# EAGLE design umodular_pot16 (EAGLE 7.2.0)
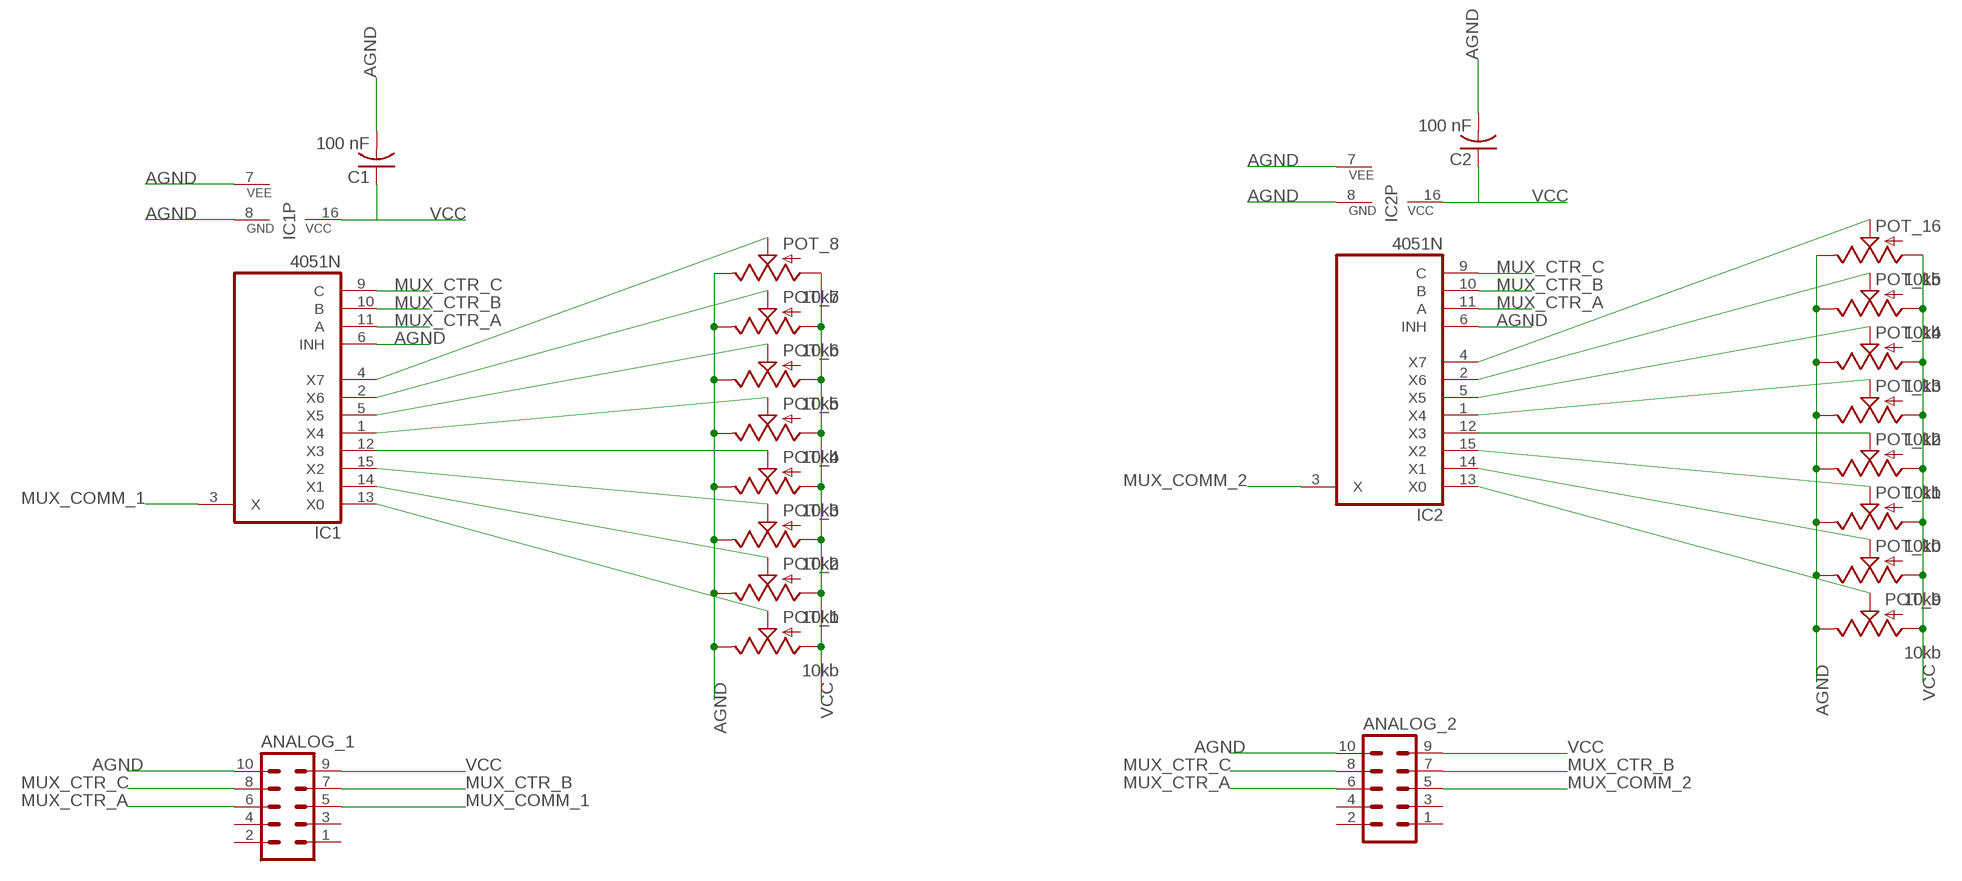
[diagram p0: schematic, sheet 1]

## Parts
ANALOG_1  MA05-2  [MA05-2]
ANALOG_2  MA05-2  [MA05-2]
C1  100 nF  C-US050-024X044  [C050-024X044]
C2  100 nF  C-US050-024X044  [C050-024X044]
IC1  4051N  [DIL16]
IC2  4051N  [DIL16]
POT_1  10kb  POT  [ALPS_POT]
POT_2  10kb  POT  [ALPS_POT]
POT_3  10kb  POT  [ALPS_POT]
POT_4  10kb  POT  [ALPS_POT]
POT_5  10kb  POT  [ALPS_POT]
POT_6  10kb  POT  [ALPS_POT]
POT_7  10kb  POT  [ALPS_POT]
POT_8  10kb  POT  [ALPS_POT]
POT_9  10kb  POT  [ALPS_POT]
POT_10  10kb  POT  [ALPS_POT]
POT_11  10kb  POT  [ALPS_POT]
POT_12  10kb  POT  [ALPS_POT]
POT_13  10kb  POT  [ALPS_POT]
POT_14  10kb  POT  [ALPS_POT]
POT_15  10kb  POT  [ALPS_POT]
POT_16  10kb  POT  [ALPS_POT]

## Nets
AGND: ANALOG_1.10 ANALOG_2.10 C1.2 C2.2 IC1.6(INH) IC1.7(VEE) IC1.8(GND) IC2.6(INH) IC2.7(VEE) IC2.8(GND) POT_1.P$1(E) POT_2.P$1(E) POT_3.P$1(E) POT_4.P$1(E) POT_5.P$1(E) POT_6.P$1(E) POT_7.P$1(E) POT_8.P$1(E) POT_9.P$1(E) POT_10.P$1(E) POT_11.P$1(E) POT_12.P$1(E) POT_13.P$1(E) POT_14.P$1(E) POT_15.P$1(E) POT_16.P$1(E)
MUX_COMM_1: ANALOG_1.5 IC1.3(X)
MUX_COMM_2: ANALOG_2.5 IC2.3(X)
MUX_CTR_A: ANALOG_1.6 ANALOG_2.6 IC1.11(A) IC2.11(A)
MUX_CTR_B: ANALOG_1.7 ANALOG_2.7 IC1.10(B) IC2.10(B)
MUX_CTR_C: ANALOG_1.8 ANALOG_2.8 IC1.9(C) IC2.9(C)
N$1: IC1.13(X0) POT_1.P$2(S)
N$10: IC1.14(X1) POT_2.P$2(S)
N$11: IC1.15(X2) POT_3.P$2(S)
N$12: IC1.12(X3) POT_4.P$2(S)
N$13: IC1.1(X4) POT_5.P$2(S)
N$14: IC1.5(X5) POT_6.P$2(S)
N$15: IC1.2(X6) POT_7.P$2(S)
N$16: IC1.4(X7) POT_8.P$2(S)
N$274: IC2.13(X0) POT_9.P$2(S)
N$275: IC2.14(X1) POT_10.P$2(S)
N$276: IC2.15(X2) POT_11.P$2(S)
N$277: IC2.12(X3) POT_12.P$2(S)
N$278: IC2.1(X4) POT_13.P$2(S)
N$279: IC2.5(X5) POT_14.P$2(S)
N$280: IC2.2(X6) POT_15.P$2(S)
N$281: IC2.4(X7) POT_16.P$2(S)
VCC: ANALOG_1.9 ANALOG_2.9 C1.1 C2.1 IC1.16(VCC) IC2.16(VCC) POT_1.P$3(A) POT_2.P$3(A) POT_3.P$3(A) POT_4.P$3(A) POT_5.P$3(A) POT_6.P$3(A) POT_7.P$3(A) POT_8.P$3(A) POT_9.P$3(A) POT_10.P$3(A) POT_11.P$3(A) POT_12.P$3(A) POT_13.P$3(A) POT_14.P$3(A) POT_15.P$3(A) POT_16.P$3(A)
Unconnected: ANALOG_1.1 ANALOG_1.2 ANALOG_1.3 ANALOG_1.4 ANALOG_2.1 ANALOG_2.2 ANALOG_2.3 ANALOG_2.4

## Library data of the parts
ANALOG_1 ANALOG_2 = con-lstb:MA05-2: PIN HEADER; OC_FARNELL: unknown; OC_NEWARK: unknown
C1 C2 = rcl:C-US: CAPACITOR, American symbol
IC1 IC2 = 40xx:4051: 8-channel ANALOG MULTIPLEXER
POT_1-POT_16 = SparkFun-Electromechanical_mod:POT

## Board
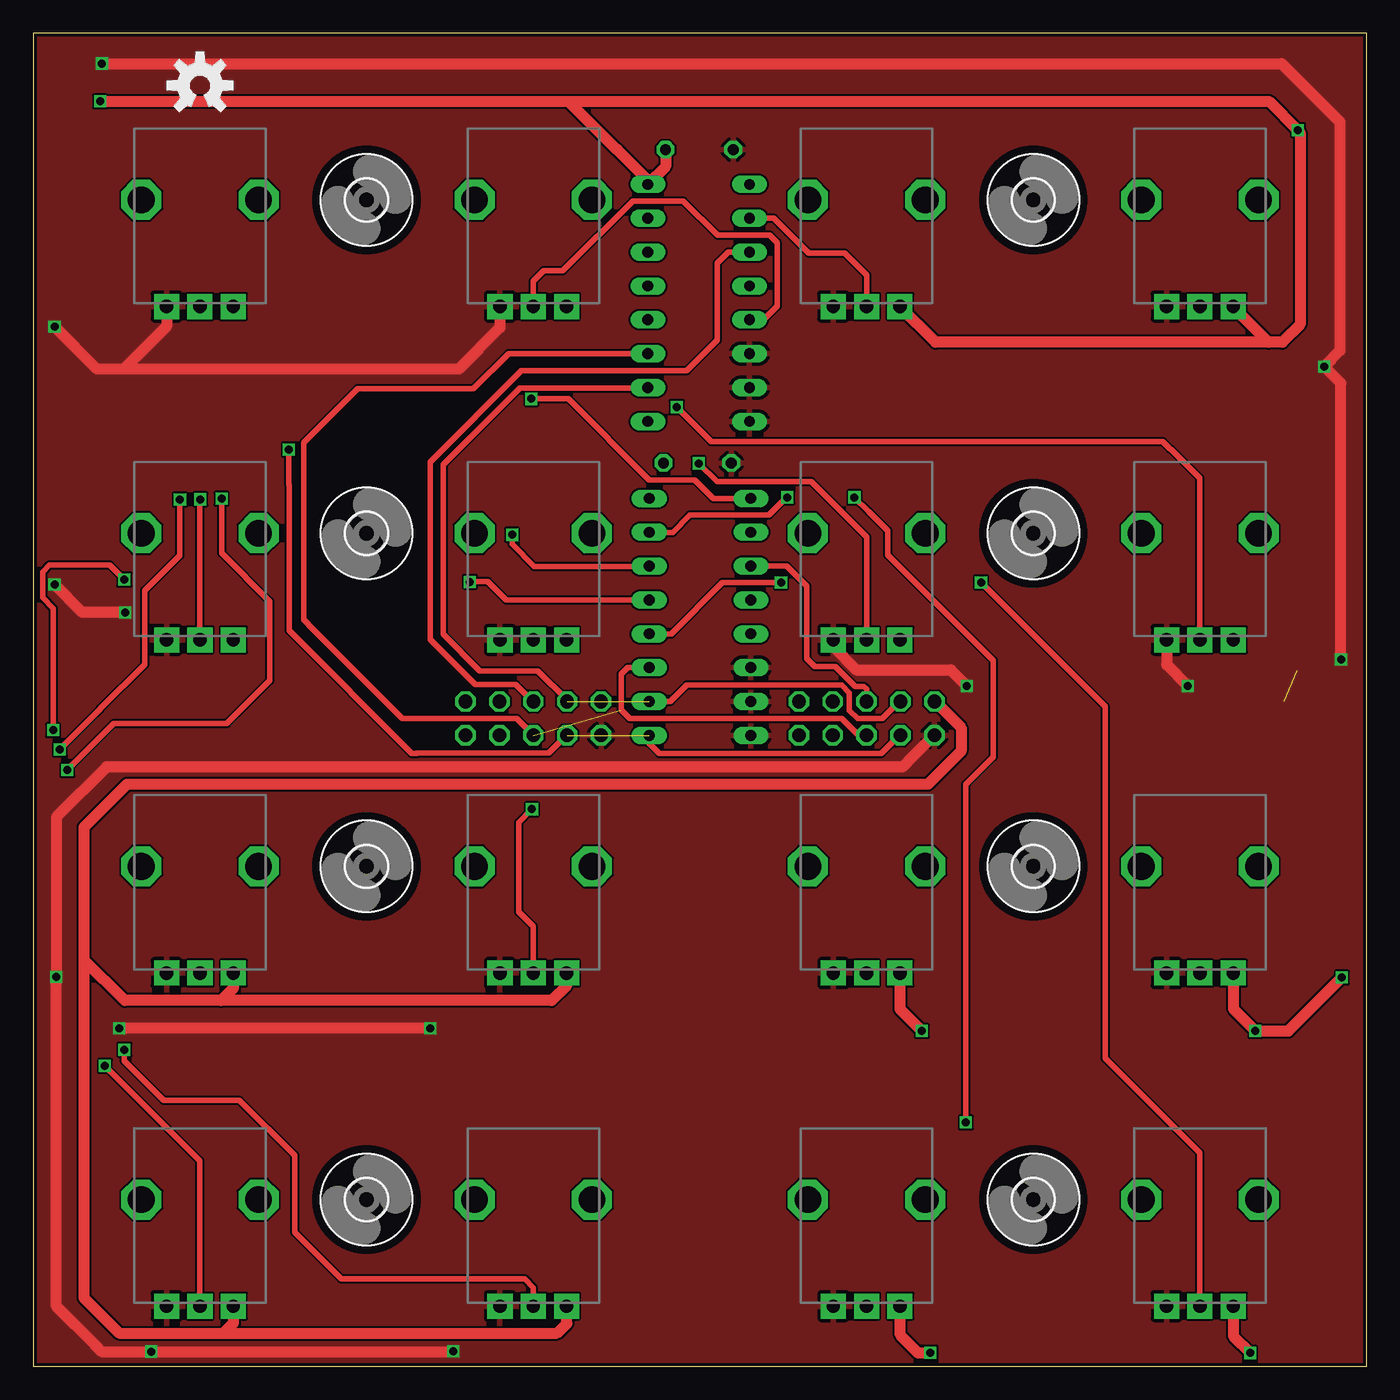
[diagram p1: board, top side]
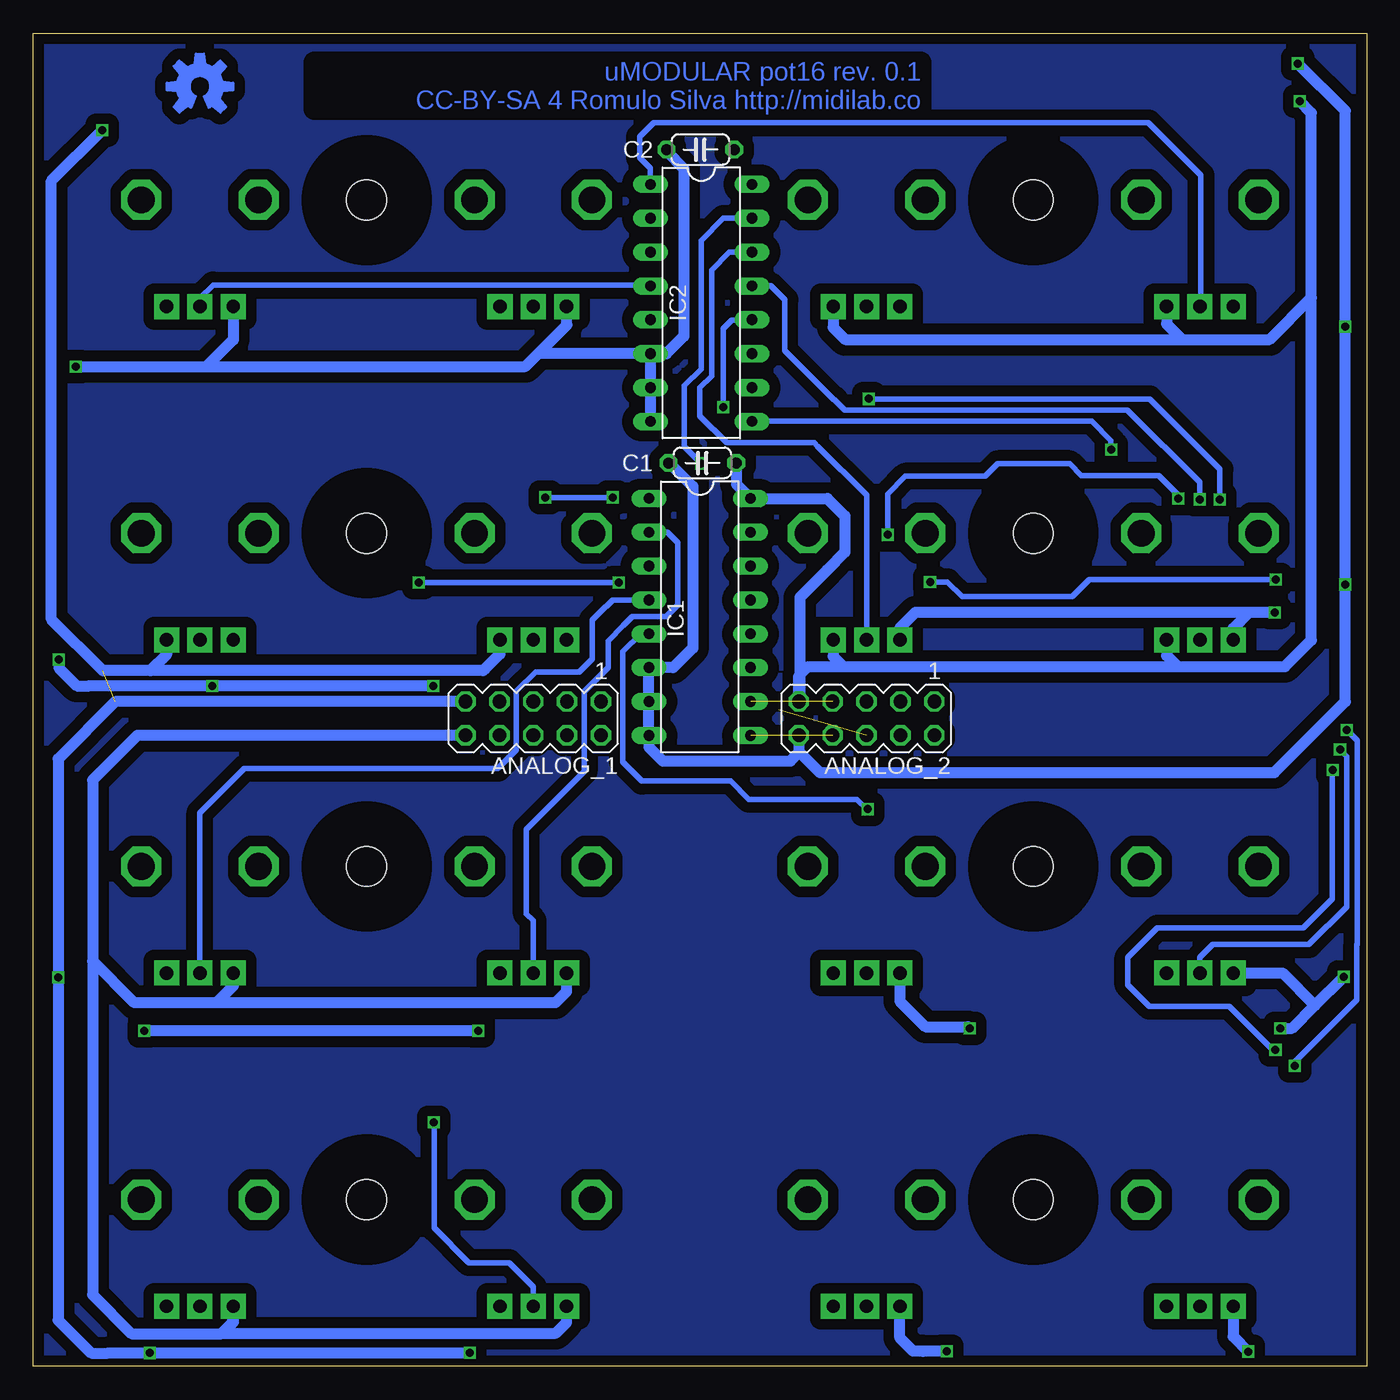
[diagram p2: board, bottom side, seen from below]

Size 100 x 100 mm. Coordinates in mm from the lower left corner, seen from the top.
Outline: 0,0 100,0 100,100 0,100 0,0
Copper layers (1*16): Top 0.035mm / dielectric 1.5mm / Bottom 0.035mm
Design rules "SeeedStudio_2layer_DRU_no_angle_20140221": minimum track width 6mil, minimum drill 12mil, track to track 6mil, track to pad 6mil, pad to pad 6mil, via to via 6mil, smd to smd 0mil, copper to edge 10mil, drill to drill 10mil, minimum pad ring 10mil, minimum via ring 6mil, stop-mask expansion 2mil, vias tented up to drill 100mil, thermal gap 10mil

### Footprints (pad centres in the part's own frame; a part is rotated, then mirrored left to right if it is on the bottom)
MA05-2 = drill 1.016 octagon: 1 -5.08,-1.27; 2 -5.08,1.27; 3 -2.54,-1.27; 4 -2.54,1.27; 5 0,-1.27; 6 0,1.27; 7 2.54,-1.27; 8 2.54,1.27; 9 5.08,-1.27; 10 5.08,1.27
C050-024X044 = drill 0.813 octagon: 1 -2.54,0; 2 2.54,0
DIL16 = drill 0.813 long: 1 -8.89,-3.81; 2 -6.35,-3.81; 3 -3.81,-3.81; 4 -1.27,-3.81; 5 1.27,-3.81; 6 3.81,-3.81; 7 6.35,-3.81; 8 8.89,-3.81; 9 8.89,3.81; 10 6.35,3.81; 11 3.81,3.81; 12 1.27,3.81; 13 -1.27,3.81; 14 -3.81,3.81; 15 -6.35,3.81; 16 -8.89,3.81
ALPS_POT = drill 1 pad 1.88 square: P$1 8,-2.5; P$2 8,0; P$3 8,2.5 | drill 2 octagon: P$4 0,-4.4; P$5 0,4.4
3,0 = hole 3: 0,0

### Placement (x,y rotation side)
ANALOG_1  62.5,48.6 180 bottom
ANALOG_2  37.5,48.6 180 bottom
C1  49.81,67.77 180 bottom
C2  49.96,91.28 180 bottom
IC1  50.01,56.22 270 bottom
IC2  49.9,79.78 270 bottom
POT_1  12.5,12.5 270 top
POT_2  37.5,12.5 270 top
POT_3  62.5,12.5 270 top
POT_4  87.5,12.5 270 top
POT_5  12.5,37.5 270 top
POT_6  37.5,37.5 270 top
POT_7  62.5,37.5 270 top
POT_8  87.5,37.5 270 top
POT_9  12.5,62.5 270 top
POT_10  37.5,62.5 270 top
POT_11  62.5,62.5 270 top
POT_12  87.5,62.5 270 top
POT_13  12.49,87.5 270 top
POT_14  37.5,87.5 270 top
POT_15  62.49,87.5 270 top
POT_16  87.5,87.5 270 top
U$1  [3,0]  25,62.5 0 top
U$2  [3,0]  25,12.5 0 top
U$4  [3,0]  25,87.5 0 top
U$5  [3,0]  75,62.5 0 top
U$6  [3,0]  75,12.5 0 top
U$8  [3,0]  25,37.5 0 top
U$9  [OSHW-LOGO-M]  12.5,96.09 0 top
U$10  [OSHW-LOGO-M]  87.5,96.01 0 top
U$12  [3,0]  75,87.5 0 top
U$13  [3,0]  75,37.5 0 top

### Tracks (layer width: path | path; a pad name or v marks a point on that pad's centre or on a via)
AGND  (via drill 0.6)
  Top 0.813: ANALOG_1.10 67.55,47.33 65.61,45.39 65.61,45.38 65.2,44.97 5.5,44.97 1.72,41.19 v1.72,29.22 v1.73,29.21 1.73,4.5 4.64,1.59 4.64,1.57 4.89,1.32 4.89,1.31 5.1,1.1 v8.86,1.1 v31.49,1.1 v31.5,1.11 | v29.77,25.36 v6.46,25.36 | v5.15,97.74 93.63,97.74 98,93.37 98,76.18 v96.82,75 98.07,73.75 v98.07,53.03 v98.08,53.02 | POT_14.P$1 35,77.91 31.91,74.82 6.79,74.82 | 6.79,74.82 4.77,74.82 v1.59,78 | POT_13.P$1 9.99,78.03 6.79,74.82 | POT_11.P$1 59.99,53.98 61.72,52.25 68.81,52.25 v70.01,51.05 | v6.9,56.56 3.68,56.56 v1.59,58.65 | POT_12.P$1 85,52.63 v86.58,51.05
  Bottom 0.813: v31.5,1.11 33.27,1.11 33.31,1.15 34.03,1.15 35.01,2.13 POT_2.P$1 | ANALOG_1.10 92.2,47.33 95.55,43.98 95.55,30.4 | 95.55,30.4 95.55,5.36 92.64,2.45 85.85,2.45 85.04,3.26 85.04,4.46 POT_4.P$1 85,3.32 85.85,2.47 60.8,2.47 59.99,3.28 POT_3.P$1 | 86.28,27.27 60.84,27.27 59.99,28.12 POT_7.P$1 | 86.28,27.27 92.42,27.27 95.55,30.4 | POT_8.P$1 85,28.55 86.28,27.27 | POT_6.P$1 35,27.38 33.09,25.47 29.88,25.47 v29.77,25.36 | v6.46,25.36 5.58,25.36 3.87,27.07 | 3.87,27.07 v1.72,29.22 | POT_5.P$1 6.3,29.5 3.87,27.07 | ANALOG_2.10 42.58,46.11 42.53,46.06 | 42.53,46.06 41,44.53 6.92,44.53 1.59,49.86 v1.59,58.65 v1.59,78 1.59,94.18 v5.15,97.74 | v96.82,75 87.01,75 | 87.01,75 63.09,75 62.12,75.97 | 62.12,75.97 59.97,78.12 59.97,79.48 POT_15.P$1 | POT_16.P$1 85,77.01 87.01,75 | 42.53,46.06 43.21,45.39 52.77,45.39 53.82,46.44 IC1.8 IC1.7 IC1.6 52,52.41 50.53,53.88 50.53,66 52.3,67.77 C1.2 | IC2.6 IC2.7 IC2.8 | IC2.6 62.12,75.97 | POT_10.P$1 35,55.39 33.82,56.57 8.78,56.57 | 8.78,56.57 v6.91,56.57 v6.9,56.56 | POT_9.P$1 10,55.35 8.78,56.57 | C2.2 52.5,91.16 51.2,89.86 51.2,77.28 52.51,75.97 IC2.6 | v70.01,51.05 v86.58,51.05 95.8,51.05 95.81,51.04 96.72,51.04 98.08,52.4 v98.08,53.02 | POT_1.P$1 10,2.24 v8.86,1.1
  pour Top: -0.05,100.14 100.38,100.14 100.38,-0.22 -0.05,-0.22
GND
  pour Bottom (isolate 0.813): -0.02,100.28 100.08,100.44 100.41,-0.2 -0.03,0 0.25,79.62
MUX_COMM_1
  Top 0.406: ANALOG_1.5 62.5,50.8 62.29,51.01 61.65,51.01 60.16,52.5 58.61,52.5 58,53.11 58,58.54 56.51,60.03 IC1.3
MUX_COMM_2
  Top 0.406: ANALOG_2.5 37.47,49.87 36.19,51.15 33.13,51.15 29.77,54.51 29.77,67.85 36.61,74.69 49,74.69 51.3,76.99 51.3,82.76 52.13,83.59 IC2.3
MUX_CTR_A  (1 unrouted)
  Top 0.406: ANALOG_1.6 61.9,47.33 60.63,48.6 44.73,48.6 44.1,49.23 44.1,51.94 44.57,52.41 IC1.11 | ANALOG_2.6 36.26,48.58 29.28,48.58 29.26,48.6 27.66,48.6 20.62,55.64 20.62,55.68 20.47,55.83 20.47,55.85 20.29,56.03 20.29,65.99 20.28,66 20.28,69.29 24.32,73.33 33.01,73.33 35.65,75.97 IC2.11
MUX_CTR_B  (1 unrouted)
  Top 0.406: ANALOG_1.7 64.96,49.87 63.67,48.58 61.84,48.58 61.21,49.21 61.21,50.52 60.62,51.11 49.02,51.11 47.78,49.87 IC1.10 | ANALOG_2.7 40.04,49.97 37.84,52.17 33.5,52.17 30.75,54.92 30.75,67.05 30.74,67.06 30.74,67.66 36.47,73.39 46.05,73.39 IC2.10
MUX_CTR_C  (via drill 0.6)  (1 unrouted)
  Top 0.406: ANALOG_1.8 64.96,47.33 63.61,45.98 46.94,45.98 46.2,46.72 IC1.9 | ANALOG_2.8 39.98,47.33 38.66,46.01 38.66,46 38.65,45.99 28.76,45.99 28.75,45.98 28.39,45.98 19.18,55.19 19.18,66.12 19.17,66.13 v19.16,68.77
  Bottom 0.406: v19.16,68.77 19.17,69.45 20.62,70.9 IC2.9
N$1  (via drill 0.6)
  Top 0.406: POT_1.P$2 12.5,15.4 v5.37,22.53 | v1.49,47.72 v1.5,47.72 1.5,56.86 0.69,57.67 0.69,59.6 1.2,60.11 5.73,60.11 v6.82,59.02 | IC1.13 35.47,57.49 34.1,58.86 v32.75,58.86 v32.74,58.85
  Bottom 0.406: v5.37,22.53 5.37,22.84 0.73,27.48 0.73,31.63 0.7,31.66 0.7,46.93 v1.49,47.72 | v6.82,59.02 20.8,59.02 22.09,57.73 30.31,57.73 31.43,58.85 v32.74,58.85
N$10  (via drill 0.6)
  Top 0.406: POT_2.P$2 37.5,5.9 36.85,6.55 23.08,6.55 19.59,10.04 19.59,15.82 15.46,19.95 9.8,19.95 6.83,22.92 v6.83,23.74 | v2.55,44.72 v2.55,44.73 6.05,48.23 14.52,48.23 17.74,51.45 17.74,57.38 14.12,61 v14.12,65.09 | v35.91,62.38 35.91,61.68 37.58,60.01 46.18,60.01 IC1.14
  Bottom 0.406: v6.83,23.74 6.63,23.81 7.12,23.81 10.31,27 16.28,27 17.9,28.62 17.9,30.66 15.69,32.87 4.76,32.87 2.58,35.05 2.58,44.69 v2.55,44.72 | v14.12,65.09 14.12,65.37 15.58,66.83 21.38,66.83 22.26,67.71 27.67,67.71 28.61,66.77 34.58,66.77 35.9,65.45 v35.9,62.39 v35.91,62.38
N$11  (via drill 0.6)
  Top 0.406: v69.95,18.28 69.95,43.66 72.01,45.72 72.01,52.93 64.07,60.87 64.07,62.7 62.65,64.12 62.65,64.13 v61.59,65.19 | v56.55,65.19 56.47,65.19 55.15,63.87 49.25,63.87 47.94,62.56 IC1.15
  Bottom 0.406: POT_3.P$2 62.5,5.97 64.3,7.77 67.33,7.77 69.94,10.38 v69.94,18.27 v69.95,18.28 | v61.59,65.19 v56.55,65.19
N$12  (via drill 0.6)
  Top 0.406: POT_4.P$2 87.5,16.01 80.4,23.11 80.4,40.3 80.39,40.31 80.39,49.49 v71.08,58.8 | v56.08,58.8 51.68,58.8 47.83,54.95 IC1.12
  Bottom 0.406: v71.08,58.8 v56.08,58.8
N$13  (via drill 0.6)
  Top 0.406: v1.99,46.26 v1.99,46.27 5.03,49.31 5.03,49.34 8.35,52.66 8.35,58.21 10.98,60.84 10.98,65 v11,65.02 | v37.35,72.58 40.11,72.58 46.2,66.49 49.6,66.49 50.98,65.11 IC1.1
  Bottom 0.406: POT_5.P$2 12.5,30.67 11.53,31.64 4.32,31.64 1.49,34.47 1.49,45.76 v1.99,46.26 | v11,65.02 11,67.3 16.17,72.47 16.17,72.48 16.26,72.57 v37.34,72.57 v37.35,72.58
N$14  (via drill 0.6)
  Top 0.406: POT_6.P$2 37.5,33 36.4,34.1 36.4,40.79 v37.4,41.79
  Bottom 0.406: v37.4,41.79 37.49,41.79 38.23,42.53 46.33,42.53 47.7,43.9 54.35,43.9 55.79,45.34 55.79,53.61 54.38,55.02 53.89,55.02 IC1.5
N$15
  Bottom 0.406: POT_7.P$2 62.5,33.43 63.01,33.94 63.01,40.28 58.68,44.61 58.68,50.63 56.89,52.42 56.89,54.41 55.74,55.56 55.74,55.57 55.08,56.23 52.54,56.23 51.65,57.12 51.65,61.78 52.45,62.58 IC1.2
N$16
  Bottom 0.406: POT_8.P$2 87.5,41.52 84.17,44.85 65.15,44.85 63.76,46.24 63.76,50.65 62.32,52.09 59.04,52.09 58.06,53.07 58.06,55.99 57.05,57 57.02,57 56.54,57.48 IC1.4
N$274  (via drill 0.6)
  Top 0.406: POT_9.P$2 12.5,65.02 v12.52,65.04
  Bottom 0.406: v12.52,65.04 12.52,66.33 17.93,71.74 39.13,71.74 39.92,72.53 39.96,72.53 43.63,76.2 43.63,80.02 44.67,81.06 IC2.13
N$275
  Bottom 0.406: POT_10.P$2 37.5,65.37 41.18,69.05 41.19,69.05 41.42,69.28 48,69.28 50,71.28 50,73.41 49.12,74.29 49.12,82.25 47.78,83.59 IC2.14
N$276  (via drill 0.6)
  Top 0.406: POT_11.P$2 62.5,62.21 58.35,66.36 51.28,66.36 v49.9,67.74
  Bottom 0.406: IC2.15 48.23,86.12 49.9,84.45 49.9,74.82 51.16,73.56 51.16,69 v49.9,67.74
N$277  (via drill 0.6)
  Top 0.406: POT_12.P$2 87.5,66.62 85.32,68.8 85.27,68.8 84.7,69.37 50.85,69.37 v48.26,71.96
  Bottom 0.406: v48.26,71.96 48.26,77.86 47.62,78.5 IC2.12
N$278
  Bottom 0.406: IC2.1 53.71,89.87 54.52,90.68 54.52,92.23 53.47,93.28 16.36,93.28 12.43,89.35 12.43,79.57 POT_13.P$2
N$279
  Top 0.406: IC2.5 54.77,78.51 55.79,79.53 55.79,84.3 55.24,84.85 51.32,84.85 48.75,87.42 44.95,87.42 39.72,82.19 38.29,82.19 37.5,81.4 POT_14.P$2
N$280
  Top 0.406: POT_15.P$2 62.49,81.88 60.87,83.5 58.15,83.5 55.53,86.12 IC2.2
N$281
  Bottom 0.406: POT_16.P$2 87.5,80.13 86.51,81.12 53.78,81.12 IC2.4
VCC  (via drill 0.6)  (1 unrouted)
  Top 0.813: ANALOG_1.9 67.63,49.87 69.59,47.91 69.59,46.14 67.1,43.65 7.01,43.65 3.79,40.43 3.79,30.5 | 3.79,30.5 3.79,5.13 5.5,3.42 5.5,3.41 6.44,2.47 14.24,2.47 | 14.24,2.47 39.29,2.47 40.01,3.19 POT_2.P$3 | POT_1.P$3 15,3.23 14.24,2.47 | v67.27,1.01 67.33,0.99 67.32,1 66.35,1 65.03,2.32 65.03,4.47 POT_3.P$3 | POT_4.P$3 90,2.25 v91.26,0.99 | POT_7.P$3 65,26.79 v66.64,25.15 | POT_8.P$3 90,26.81 v91.66,25.15 94.13,25.15 v98.14,29.16 | POT_6.P$3 40,28.55 38.88,27.43 14.08,27.43 | 14.08,27.43 6.86,27.43 3.79,30.5 | POT_5.P$3 15,28.35 14.08,27.43 | v5.02,94.9 40.12,94.9 | 40.12,94.9 92.68,94.9 v94.84,92.74 95.02,92.56 95.02,78.16 93.68,76.82 92.64,76.82 | 92.64,76.82 67.68,76.82 POT_15.P$3 | POT_16.P$3 90,79.46 92.64,76.82 | 40.12,94.9 43.74,91.28 43.8,91.28 46.09,88.99 IC2.16 47.42,90 C2.1
  Bottom 0.813: ANALOG_1.9 93.84,49.87 98.14,45.57 v98.14,29.16 98.14,3.46 95.65,0.97 94.41,0.97 94.39,0.99 v91.26,0.99 v67.27,1.01 | 39.24,52.49 41.91,52.49 42.58,51.82 ANALOG_2.9 42.5,49.95 42.5,57.69 40.45,59.74 40.45,59.75 39.12,61.08 39.12,63.79 40.44,65.11 IC1.16 47.27,66.18 C1.1 | 39.24,52.49 14.17,52.49 | 14.17,52.49 6.12,52.49 4.14,54.47 4.14,80.17 | 4.14,80.17 4.14,94.02 v5.02,94.9 | POT_10.P$3 40,53.25 39.24,52.49 | POT_9.P$3 15,53.32 14.17,52.49 | POT_14.P$3 40,77.93 39.11,77.04 13.84,77.04 | 13.84,77.04 7.27,77.04 4.14,80.17 | POT_13.P$3 14.99,78.19 13.84,77.04 | POT_11.P$3 65,53.42 66.12,52.3 66.16,52.3 66.28,52.18 91.21,52.18 | 91.21,52.18 94.78,52.18 98.64,56.04 98.64,88.94 v94.84,92.74 | POT_12.P$3 90,53.39 91.21,52.18 | v66.64,25.15 v91.66,25.15

### Text on the board
Bottom: uMODULAR pot16 rev. 0.1 / CC-BY-SA 4 Romulo Silva http://midilab.co
tValues: uMODULAR pot16 rev. 0.1 / CC-BY-SA 4 Romulo Silva http://midilab.co | 10kb | 10kb | 10kb | 10kb | ANALOG_13 | ANALOG_14 | ANALOG_15 | ANALOG_16 | 10kb | 10kb | 10kb | 10kb | ANALOG_9 | ANALOG_10 | ANALOG_11 | ANALOG_12 | 10kb | 10kb | 10kb | 10kb | ANALOG_5 | ANALOG_6 | ANALOG_7 | ANALOG_8 | 10kb | 10kb | 10kb | 10kb | ANALOG_1 | ANALOG_2 | ANALOG_3 | ANALOG_4